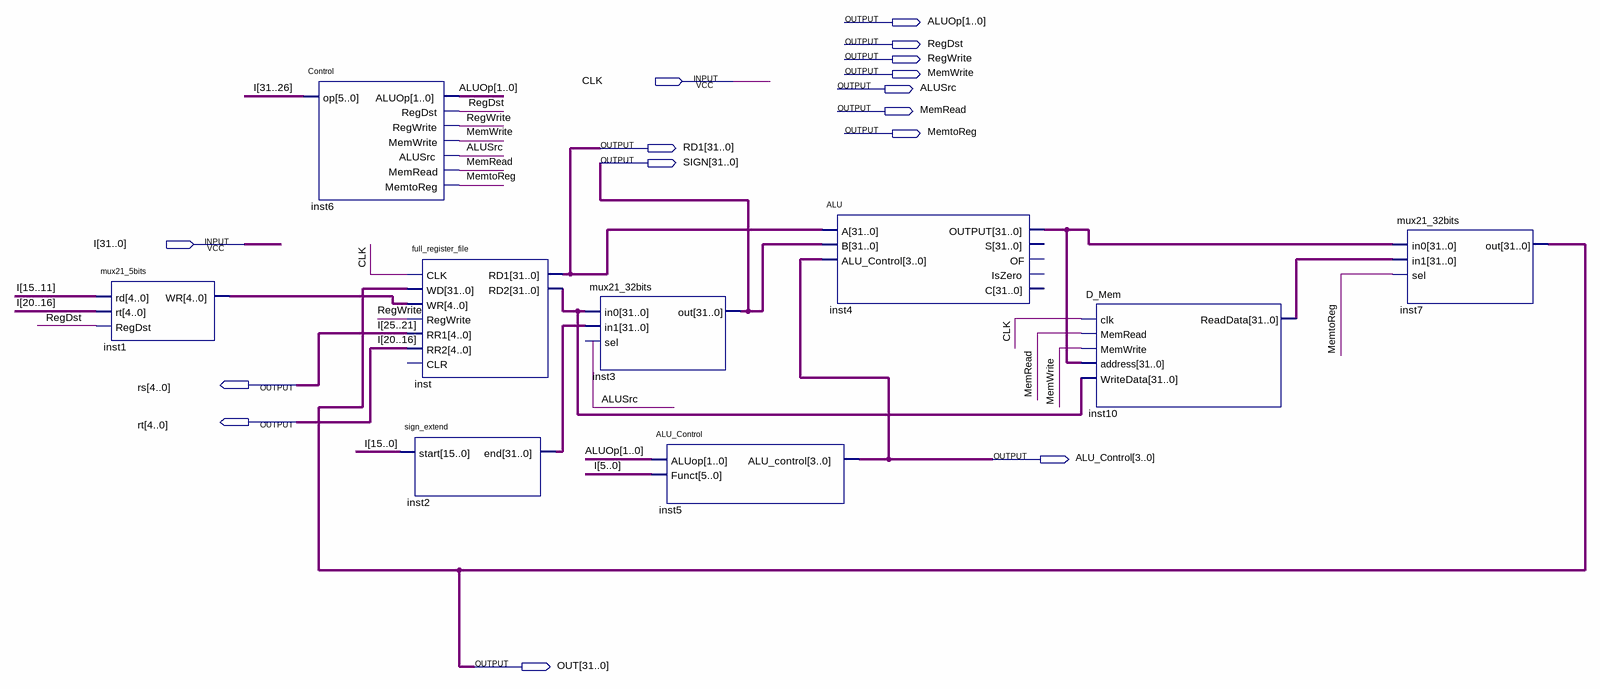
[diagram p0: schematic sheet]
// Quartus schematic Mips.bdf as structural Verilog: 9 symbols, 15 pins
module Mips (
  input  CLK,
  input  [31:0] I,
  output [1:0] ALUOp,
  output RegDst,
  output RegWrite,
  output MemWrite,
  output ALUSrc,
  output MemRead,
  output MemtoReg,
  output [31:0] RD1,
  output [31:0] SIGN,
  output [4:0] rs,
  output [4:0] rt,
  output [3:0] ALU_Control,
  output [31:0] OUT
);

  wire [4:0] inst1_wr;
  wire [31:0] inst2_end, inst4_output, inst10_readdata, inst_rd2;

  mux21_5bits inst1 (.rd(I[15:11]), .rt(I[20:16]), .RegDst(RegDst), .WR(inst1_wr));
  Control inst6 (
    .op(I[31:26]), .ALUOp(ALUOp), .RegDst(RegDst), .RegWrite(RegWrite), .MemWrite(MemWrite), .ALUSrc(ALUSrc),
    .MemRead(MemRead), .MemtoReg(MemtoReg));
  full_register_file inst (
    .CLK(CLK), .WD(OUT), .WR(inst1_wr), .RegWrite(RegWrite), .RR1(I[25:21]), .RR2(I[20:16]), .RD1(RD1),
    .RD2(inst_rd2));  // open: CLR
  sign_extend inst2 (.start(I[15:0]), .\end (inst2_end));
  mux21_32bits inst3 (.in0(inst_rd2), .in1(inst2_end), .sel(ALUSrc), .out(SIGN));
  ALU_Control inst5 (.ALUop(ALUOp), .Funct(I[5:0]), .ALU_control(ALU_Control));
  ALU inst4 (.A(RD1), .B(SIGN), .ALU_Control(ALU_Control), .OUTPUT(inst4_output));  // open: S, OF, IsZero, C
  D_Mem inst10 (
    .clk(CLK), .MemRead(MemRead), .MemWrite(MemWrite), .address(inst4_output), .WriteData(inst_rd2),
    .ReadData(inst10_readdata));
  mux21_32bits inst7 (.in0(inst4_output), .in1(inst10_readdata), .sel(MemtoReg), .out(OUT));

  assign rs = I[25:21];
  assign rt = I[20:16];
endmodule
